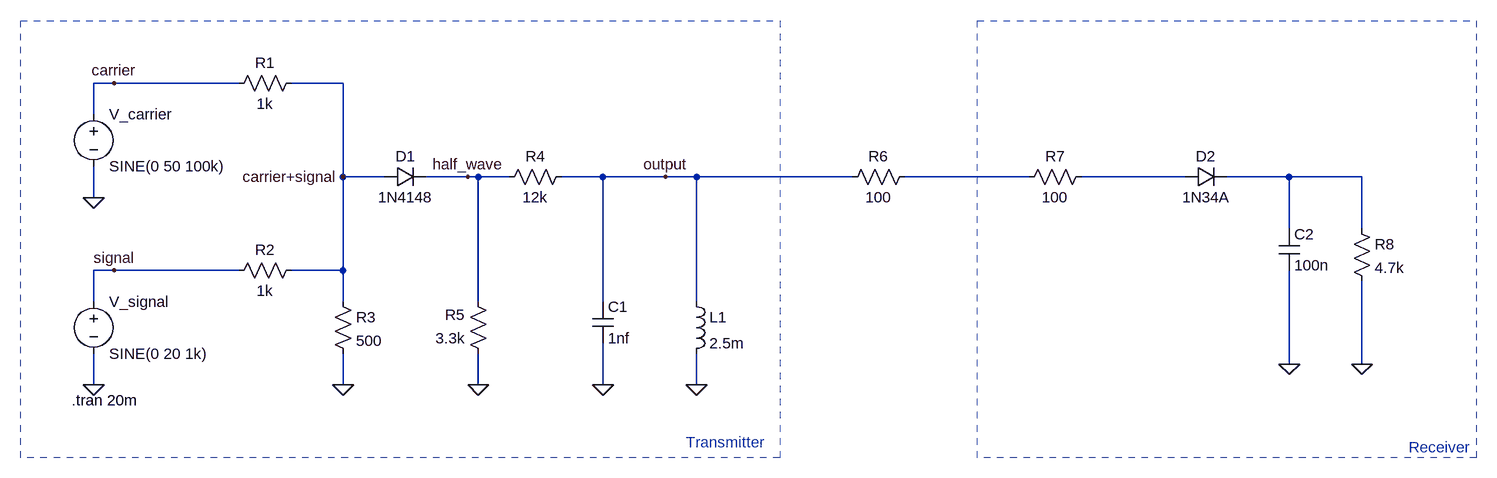
[diagram p0: schematic transmitter_receiver.asc]
transmitter_receiver.asc, the LTspice schematic file:
Version 4
SHEET 1 1928 680
WIRE -176 -64 -208 -64
WIRE 16 -64 -176 -64
WIRE 176 -64 96 -64
WIRE -208 -16 -208 -64
WIRE 176 80 176 -64
WIRE 240 80 176 80
WIRE 368 80 304 80
WIRE 384 80 368 80
WIRE 432 80 384 80
WIRE 576 80 512 80
WIRE 672 80 576 80
WIRE 720 80 672 80
WIRE 960 80 720 80
WIRE 1232 80 1040 80
WIRE 1472 80 1312 80
WIRE 1632 80 1536 80
WIRE 1744 80 1632 80
WIRE -208 112 -208 64
WIRE 1632 160 1632 80
WIRE 1744 160 1744 80
WIRE -176 224 -208 224
WIRE 16 224 -176 224
WIRE 176 224 176 80
WIRE 176 224 96 224
WIRE -208 272 -208 224
WIRE 176 272 176 224
WIRE 384 272 384 80
WIRE 576 272 576 80
WIRE 720 272 720 80
WIRE 1632 368 1632 224
WIRE 1744 368 1744 240
WIRE -208 400 -208 352
WIRE 176 400 176 352
WIRE 384 400 384 352
WIRE 576 400 576 336
WIRE 720 400 720 352
FLAG -208 112 0
FLAG -176 224 signal
FLAG -208 400 0
FLAG -176 -64 carrier
FLAG 176 400 0
FLAG 384 400 0
FLAG 576 400 0
FLAG 720 400 0
FLAG 176 80 carrier+signal
FLAG 368 80 half_wave
FLAG 672 80 output
FLAG 1632 368 0
FLAG 1744 368 0
SYMBOL voltage -208 256 R0
WINDOW 123 0 0 Left 0
WINDOW 39 0 0 Left 0
SYMATTR InstName V_signal
SYMATTR Value SINE(0 20 1k)
SYMBOL voltage -208 -32 R0
WINDOW 123 0 0 Left 0
WINDOW 39 0 0 Left 0
SYMATTR InstName V_carrier
SYMATTR Value SINE(0 50 100k)
SYMBOL res 112 -80 R90
WINDOW 0 0 56 VBottom 2
WINDOW 3 32 56 VTop 2
SYMATTR InstName R1
SYMATTR Value 1k
SYMBOL res 112 208 R90
WINDOW 0 0 56 VBottom 2
WINDOW 3 32 56 VTop 2
SYMATTR InstName R2
SYMATTR Value 1k
SYMBOL diode 240 96 R270
WINDOW 0 32 32 VTop 2
WINDOW 3 0 32 VBottom 2
SYMATTR InstName D1
SYMATTR Value 1N4148
SYMBOL res 160 256 R0
SYMATTR InstName R3
SYMATTR Value 500
SYMBOL res 528 64 R90
WINDOW 0 0 56 VBottom 2
WINDOW 3 32 56 VTop 2
SYMATTR InstName R4
SYMATTR Value 12k
SYMBOL res 400 368 R180
WINDOW 0 36 76 Left 2
WINDOW 3 36 40 Left 2
SYMATTR InstName R5
SYMATTR Value 3.3k
SYMBOL cap 560 272 R0
SYMATTR InstName C1
SYMATTR Value 1nf
SYMBOL ind 704 256 R0
SYMATTR InstName L1
SYMATTR Value 2.5m
SYMBOL res 944 96 R270
WINDOW 0 32 56 VTop 2
WINDOW 3 0 56 VBottom 2
SYMATTR InstName R6
SYMATTR Value 100
SYMBOL res 1328 64 R90
WINDOW 0 0 56 VBottom 2
WINDOW 3 32 56 VTop 2
SYMATTR InstName R7
SYMATTR Value 100
SYMBOL diode 1472 96 R270
WINDOW 0 32 32 VTop 2
WINDOW 3 0 32 VBottom 2
SYMATTR InstName D2
SYMATTR Value 1N34A
SYMBOL cap 1616 160 R0
SYMATTR InstName C2
SYMATTR Value 100n
SYMBOL res 1728 144 R0
SYMATTR InstName R8
SYMATTR Value 4.7k
TEXT -242 424 Left 2 !.tran 20m
TEXT 704 488 Left 2 ;Transmitter
TEXT 1816 496 Left 2 ;Receiver
RECTANGLE Normal 848 512 -320 -160 2
RECTANGLE Normal 1920 512 1152 -160 2

The netlist it stands for:
* transmitter_receiver.asc
V_signal signal 0 SINE(0 20 1k)
V_carrier carrier 0 SINE(0 50 100k)
R1 carrier+signal carrier 1k
R2 carrier+signal signal 1k
D1 carrier+signal half_wave 1N4148
R3 carrier+signal 0 500
R4 output half_wave 12k
R5 0 half_wave 3.3k
C1 output 0 1nf
L1 output 0 2.5m
R6 output N001 100
R7 N002 N001 100
D2 N002 N003 1N34A
C2 N003 0 100n
R8 N003 0 4.7k
.model D D
.lib standard.dio
.tran 20m
* Transmitter
* Receiver
.backanno
.end